# EAGLE design base-3u-motor-controller (EAGLE 5.06)
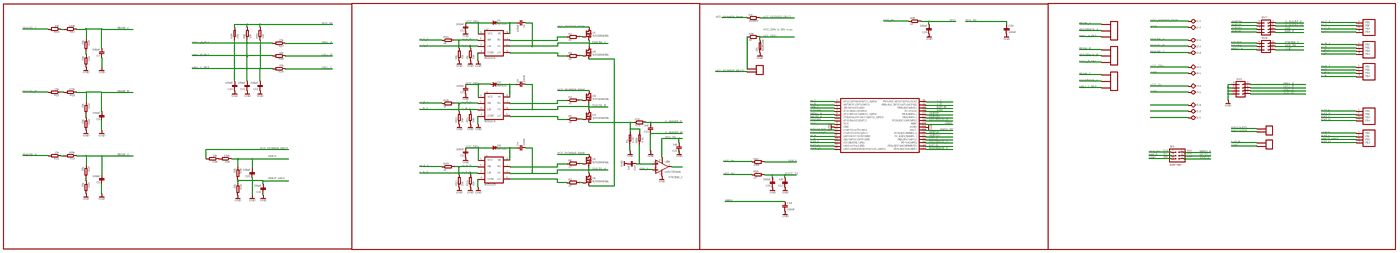
[diagram p0: schematic, sheet 1, overview]
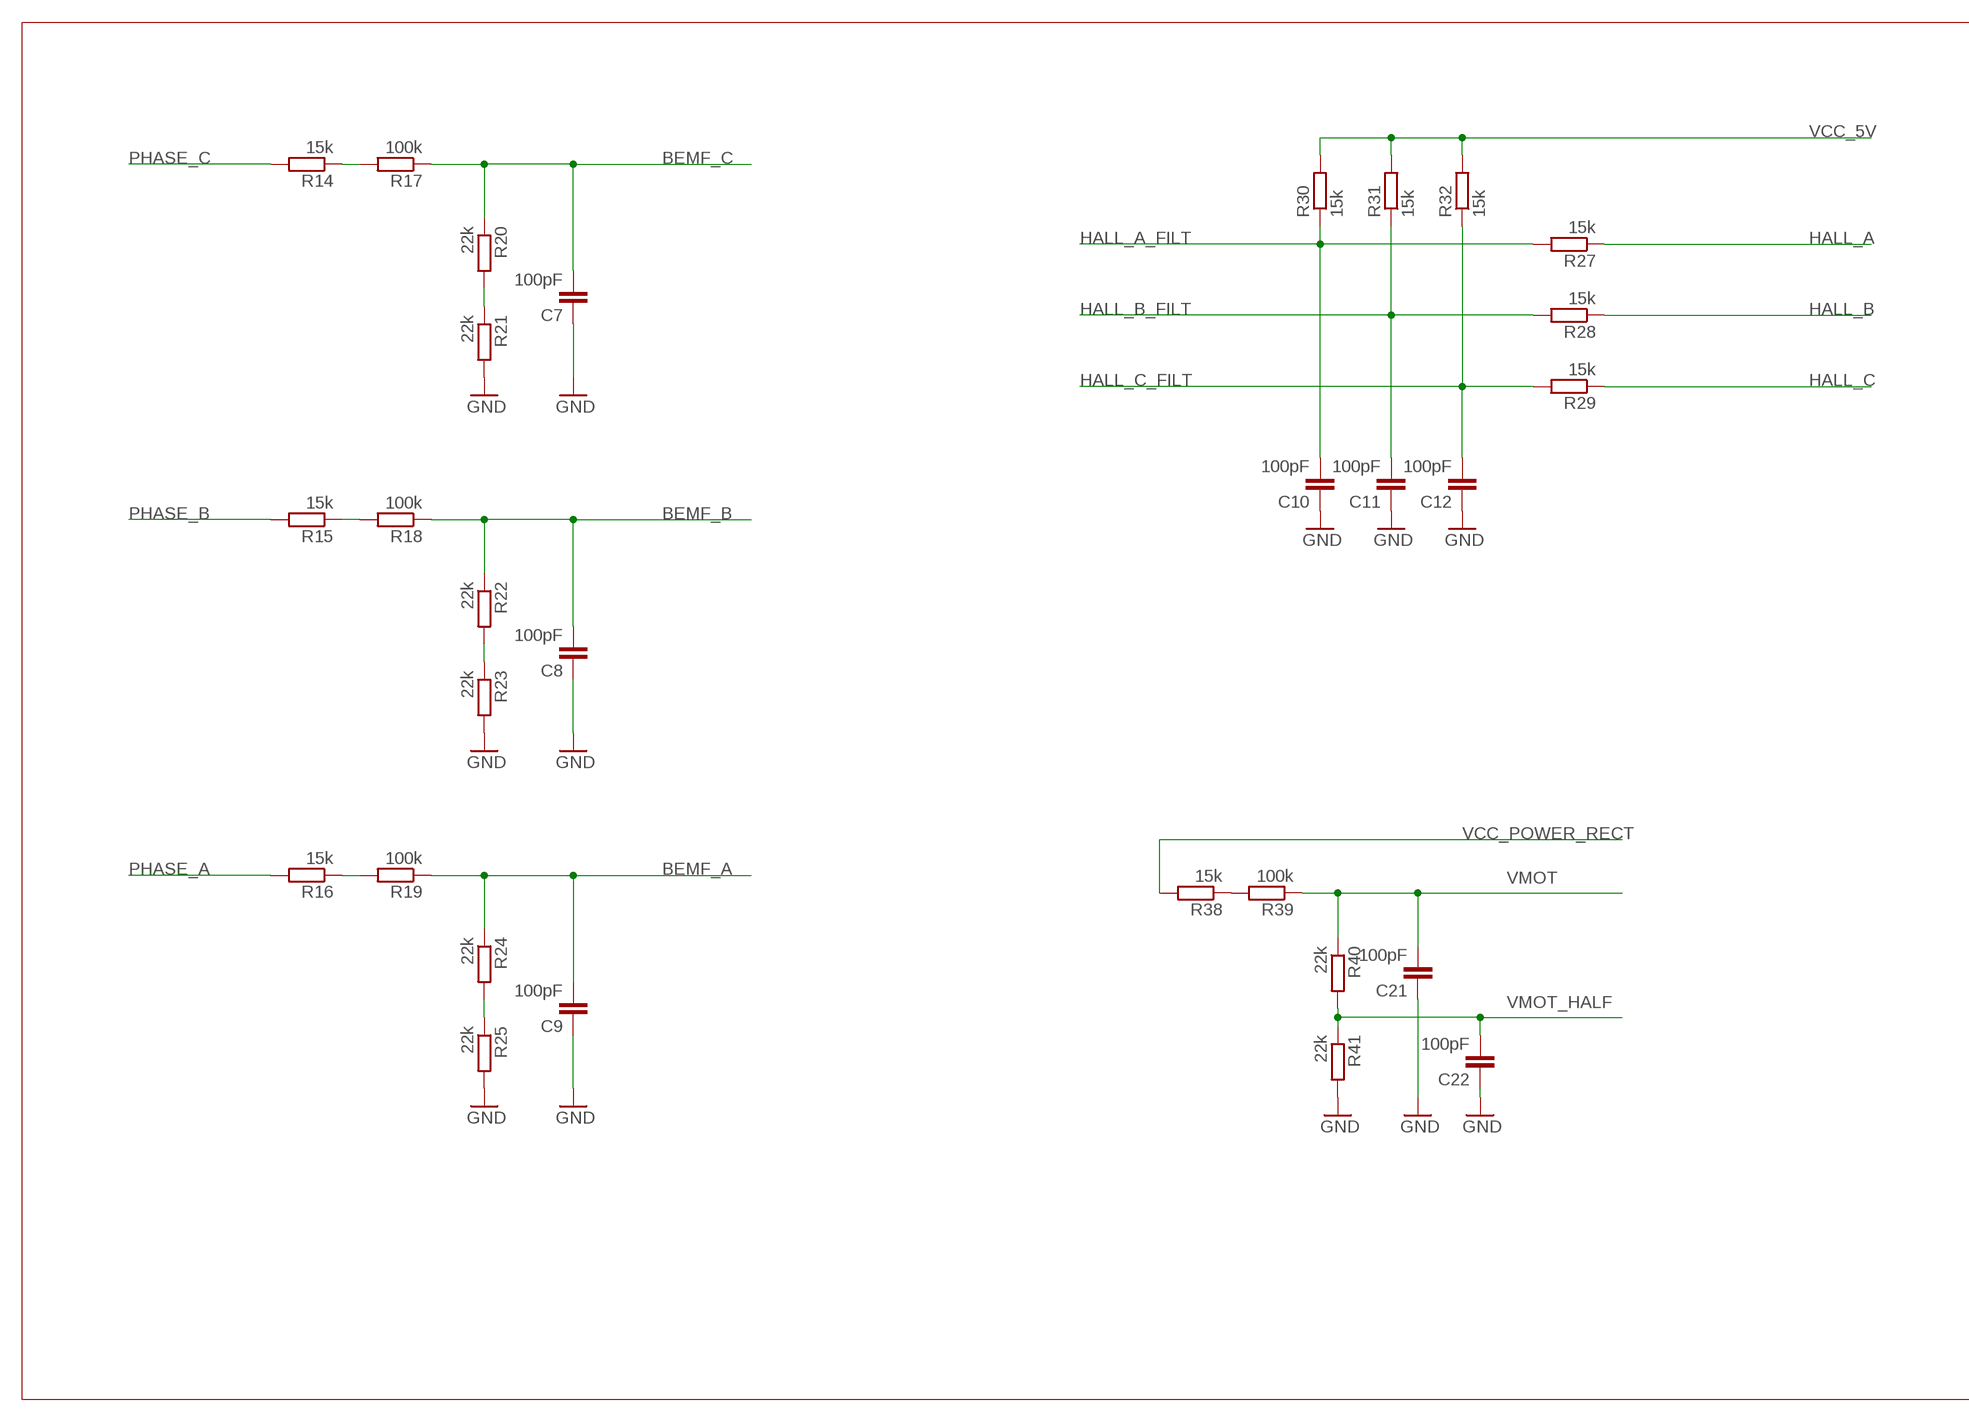
[diagram p1: schematic, sheet 1, part 1 of 4]
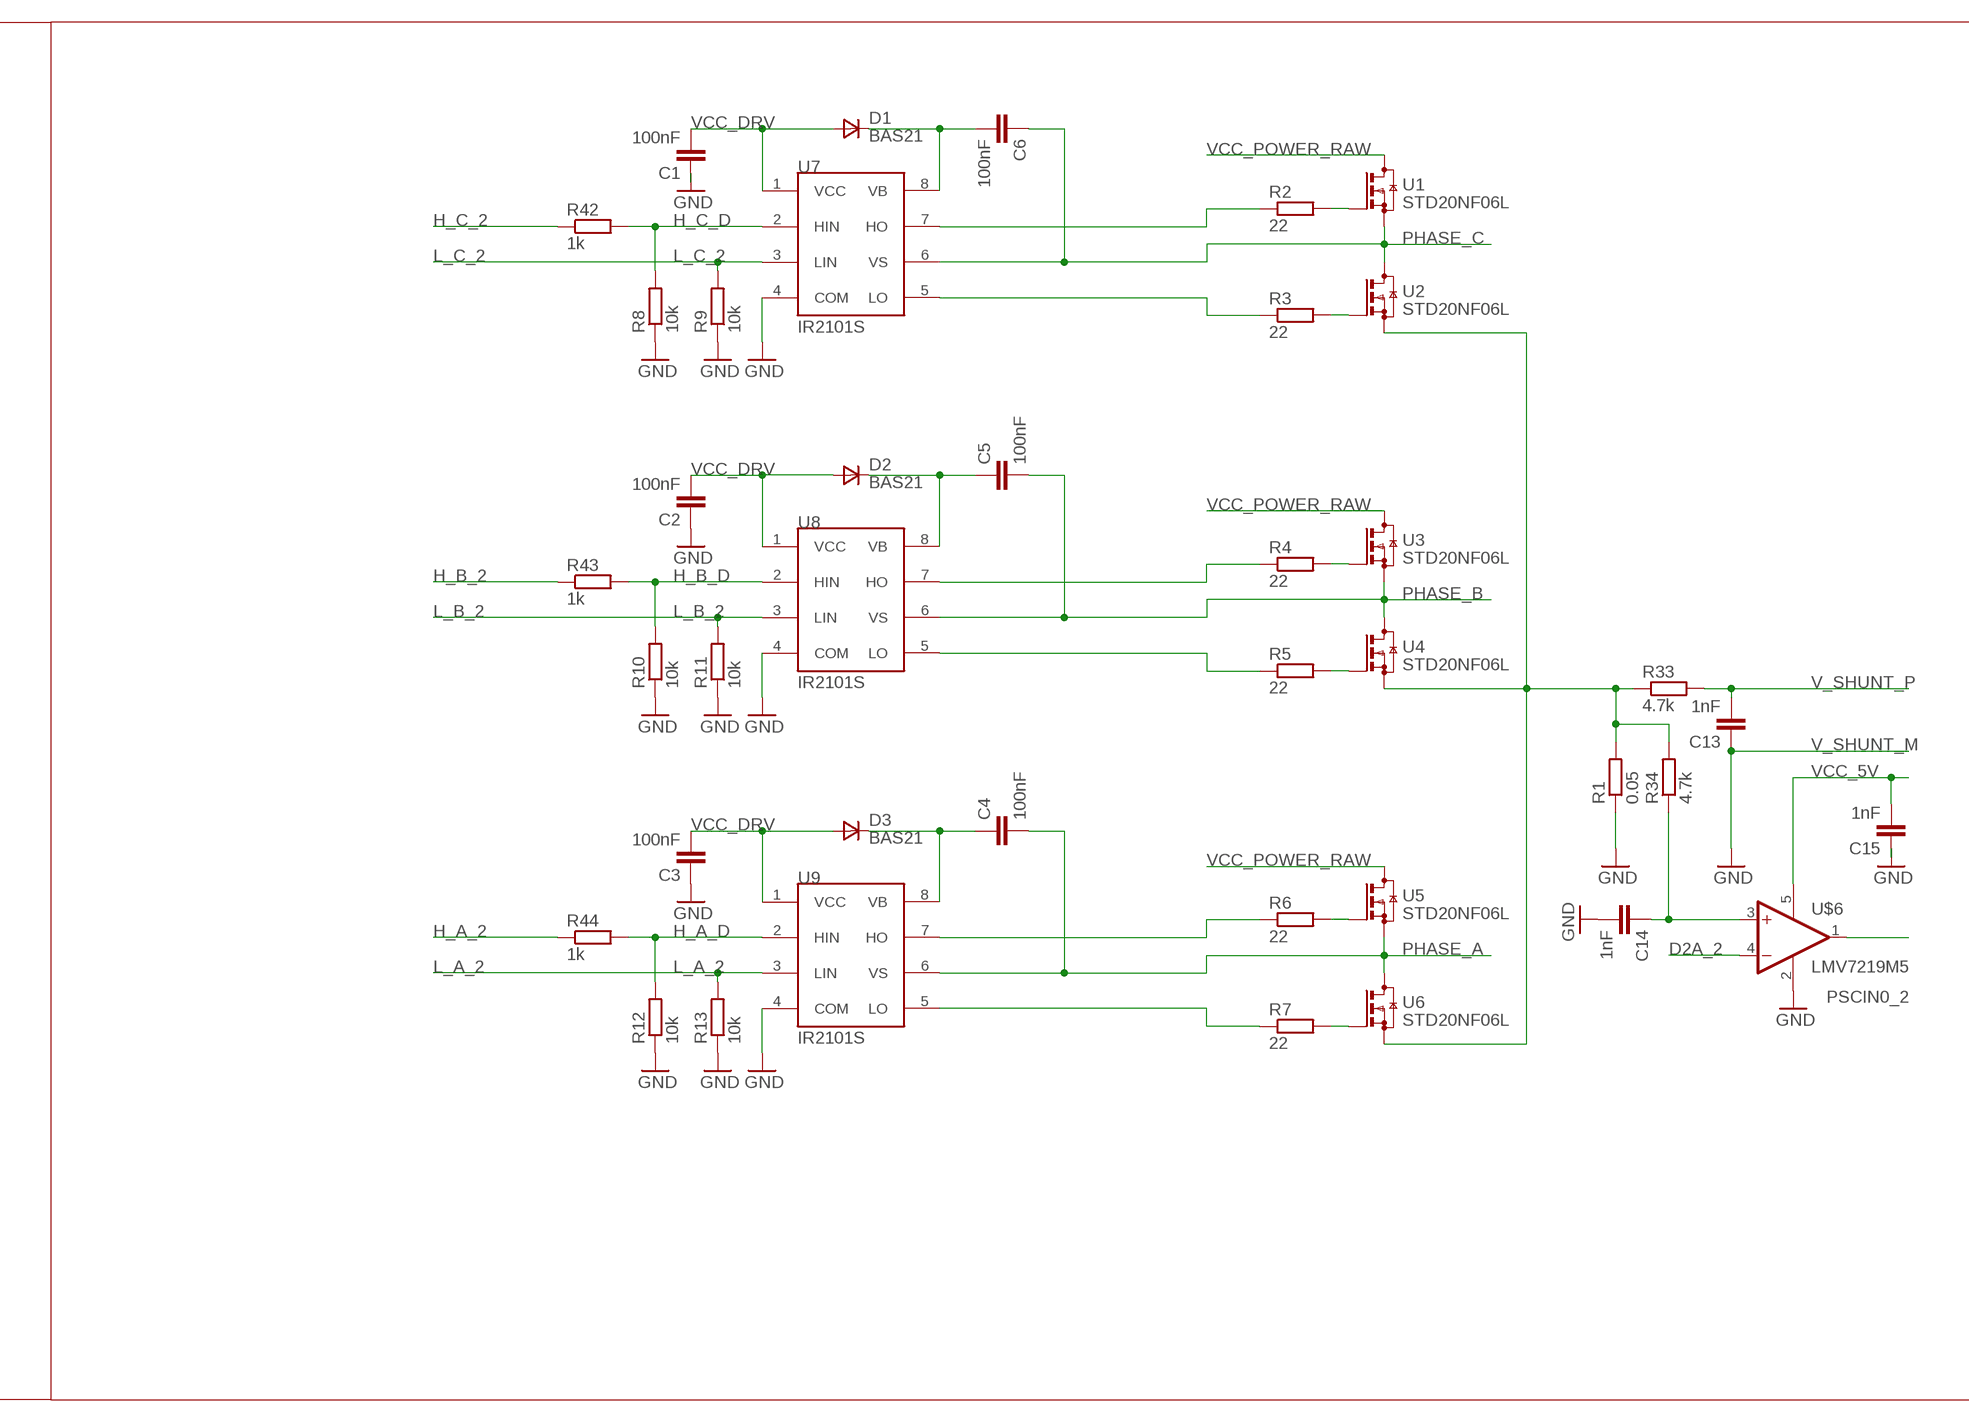
[diagram p2: schematic, sheet 1, part 2 of 4]
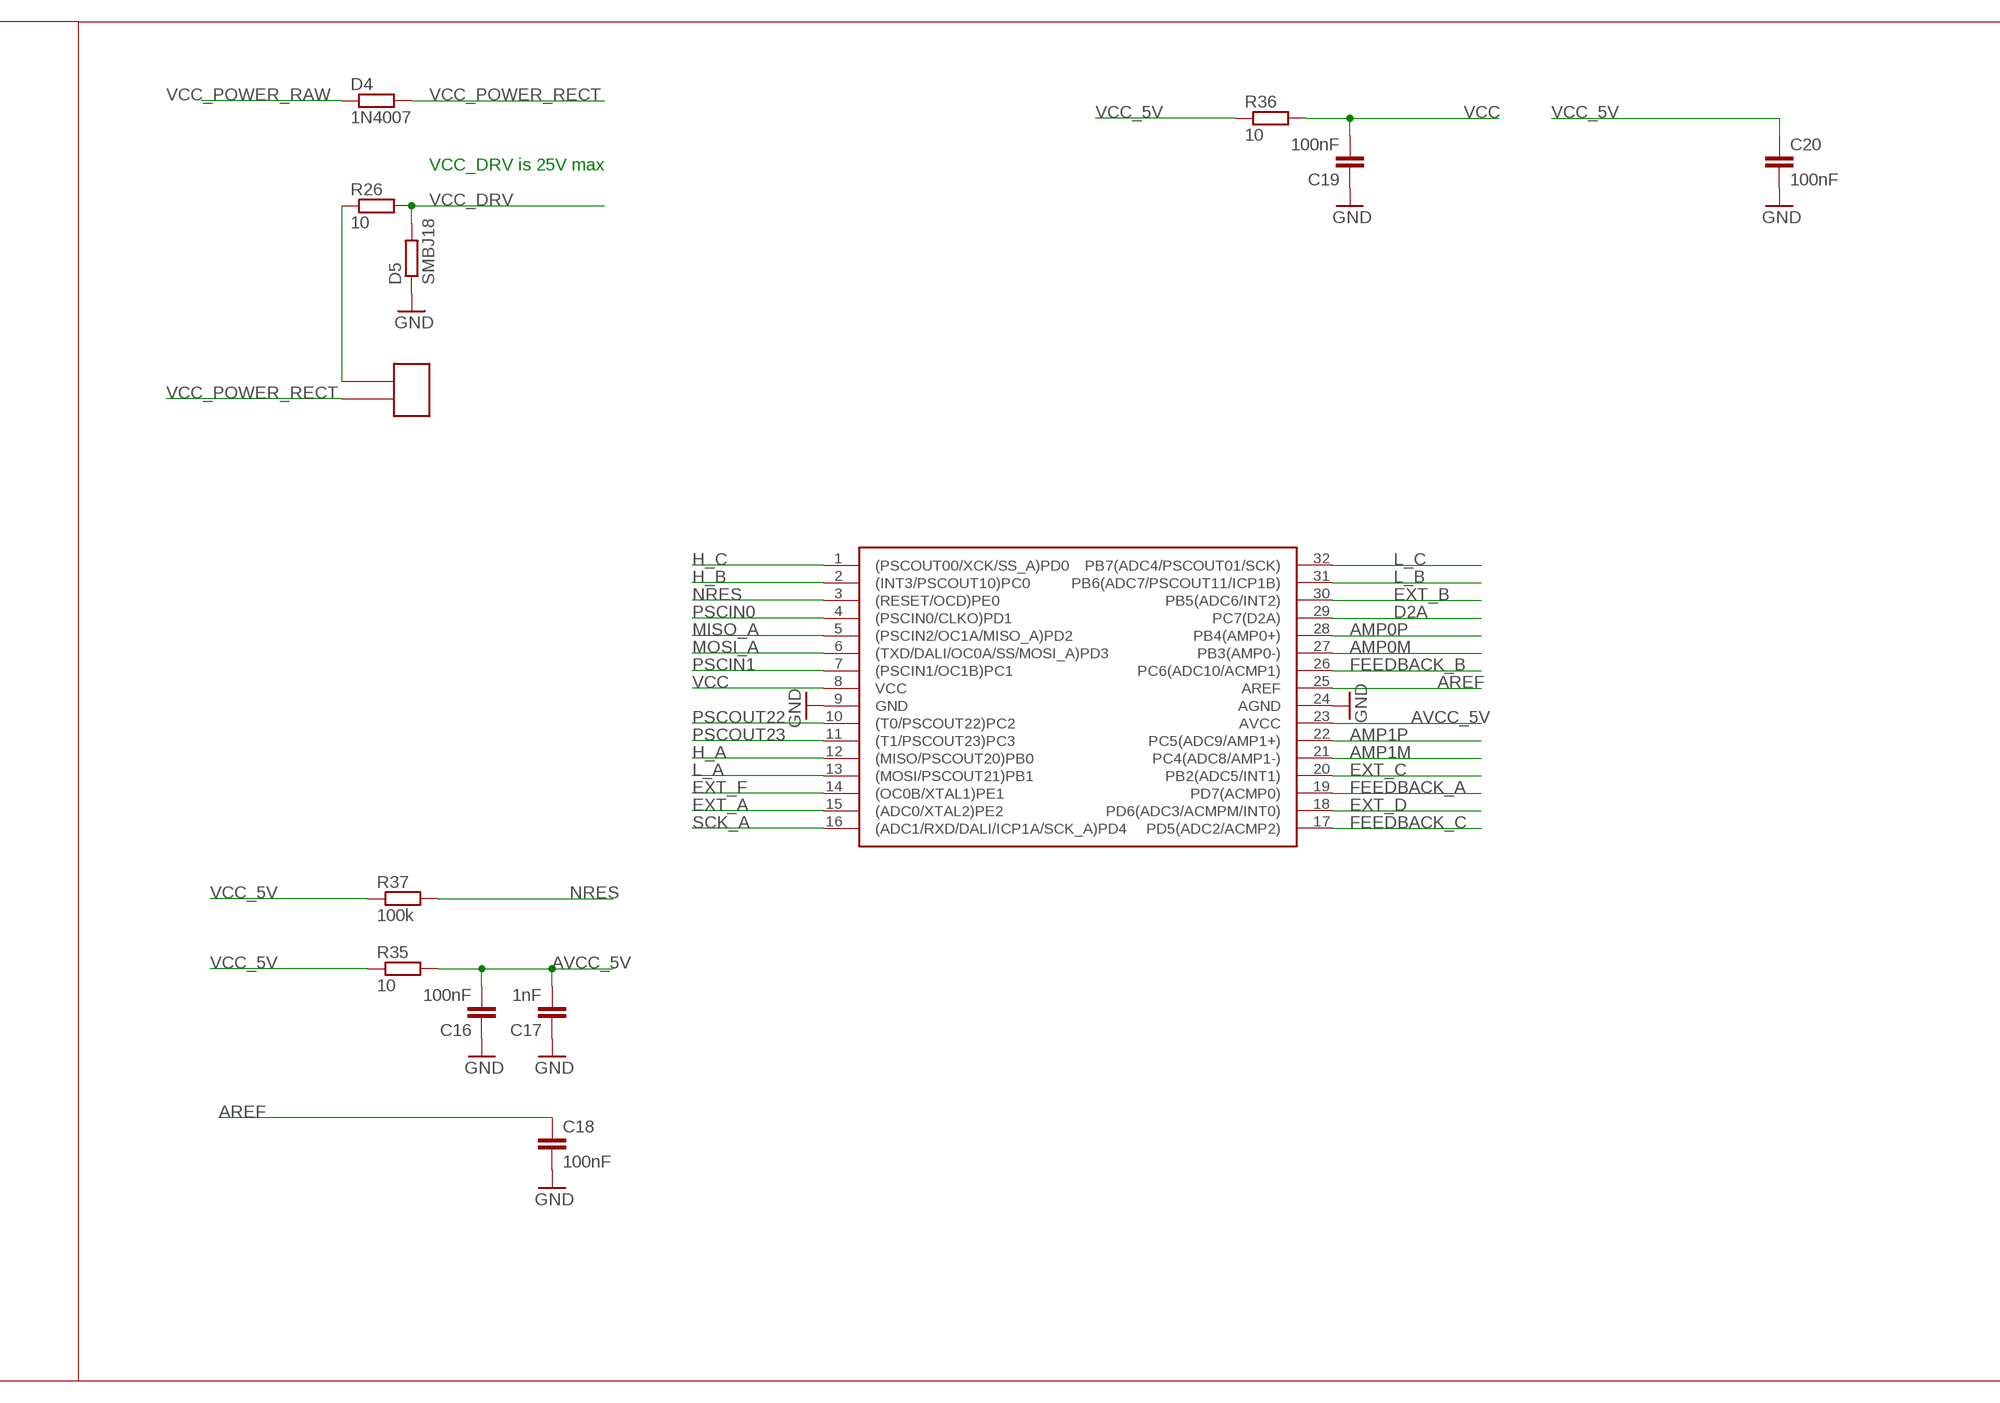
[diagram p3: schematic, sheet 1, part 3 of 4]
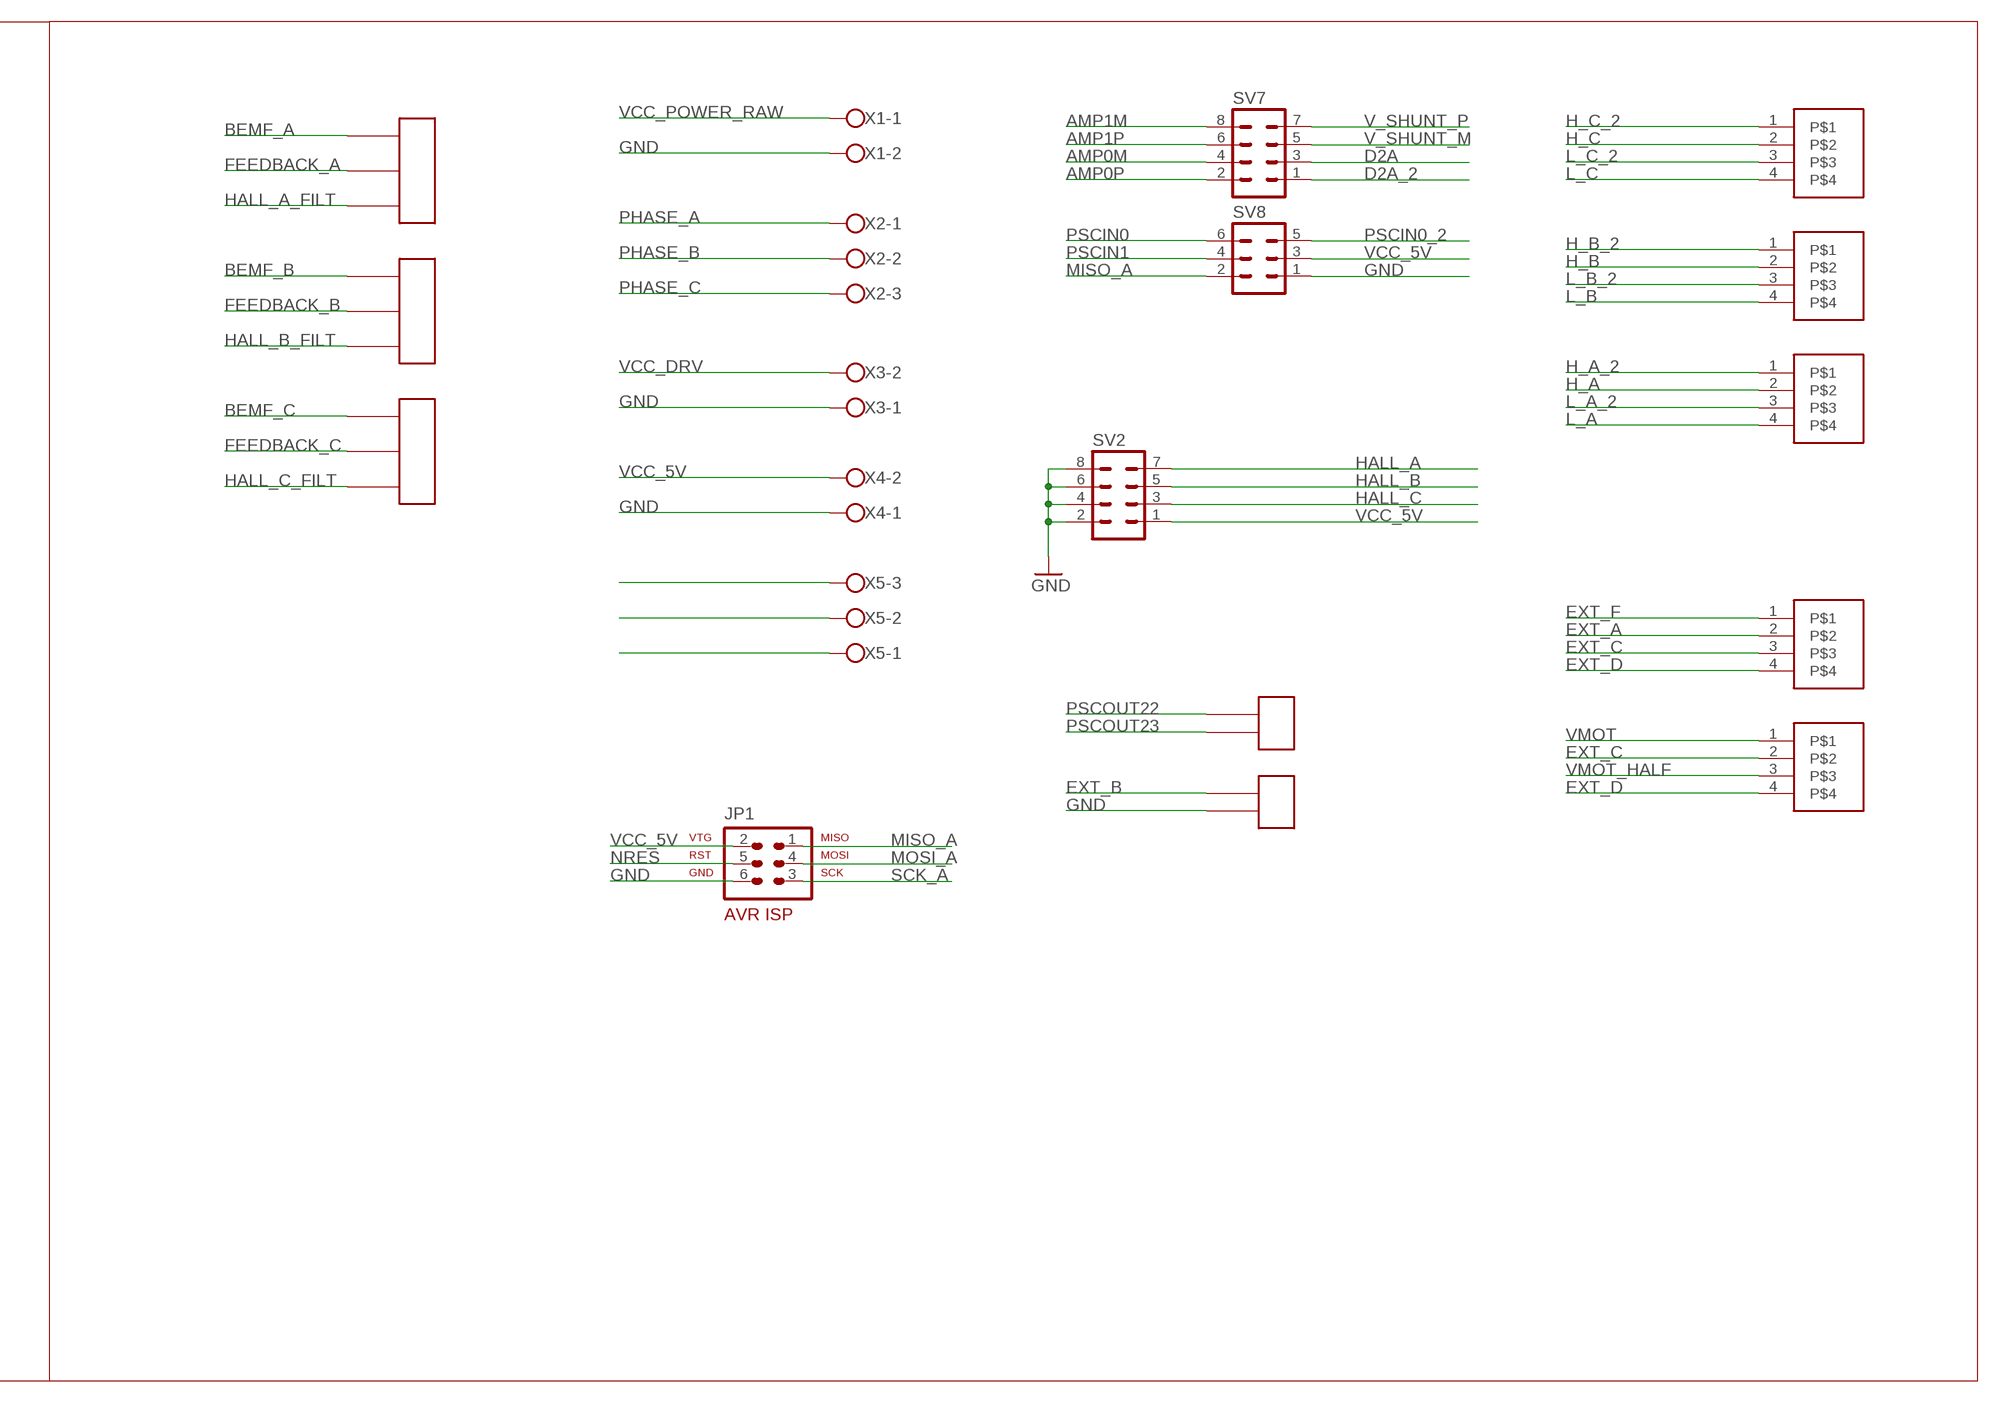
[diagram p4: schematic, sheet 1, part 4 of 4]

## Parts
C1  100nF  C-EUC0805  [C0805]
C2  100nF  C-EUC0805  [C0805]
C3  100nF  C-EUC0805  [C0805]
C4  100nF  C-EUC0805  [C0805]
C5  100nF  C-EUC0805  [C0805]
C6  100nF  C-EUC0805  [C0805]
C7  100pF  C-EUC0805  [C0805]
C8  100pF  C-EUC0805  [C0805]
C9  100pF  C-EUC0805  [C0805]
C10  100pF  C-EUC0805  [C0805]
C11  100pF  C-EUC0805  [C0805]
C12  100pF  C-EUC0805  [C0805]
C13  1nF  C-EUC0805  [C0805]
C14  1nF  C-EUC0805  [C0805]
C15  1nF  C-EUC0805  [C0805]
C16  100nF  C-EUC0805  [C0805]
C17  1nF  C-EUC0805  [C0805]
C18  100nF  C-EUC0805  [C0805]
C19  100nF  C-EUC0805  [C0805]
C20  100nF  C-EUC0805  [C0805]
C21  100pF  C-EUC0805  [C0805]
C22  100pF  C-EUC0805  [C0805]
D1  BAS21  DSOT23  [SOT-23]
D2  BAS21  DSOT23  [SOT-23]
D3  BAS21  DSOT23  [SOT-23]
D4  1N4007  R-EU_R2010  [R2010]
D5  SMBJ18  R-EU_R2010  [R2010]
JP1  AVR-ISP-6  [AVR-ISP-6]
R1  0.05  R-EU_R2512  [R2512]
R2  22  R-EU_R0805  [R0805]
R3  22  R-EU_R0805  [R0805]
R4  22  R-EU_R0805  [R0805]
R5  22  R-EU_R0805  [R0805]
R6  22  R-EU_R0805  [R0805]
R7  22  R-EU_R0805  [R0805]
R8  10k  R-EU_R0805  [R0805]
R9  10k  R-EU_R0805  [R0805]
R10  10k  R-EU_R0805  [R0805]
R11  10k  R-EU_R0805  [R0805]
R12  10k  R-EU_R0805  [R0805]
R13  10k  R-EU_R0805  [R0805]
R14  15k  R-EU_R0805  [R0805]
R15  15k  R-EU_R0805  [R0805]
R16  15k  R-EU_R0805  [R0805]
R17  100k  R-EU_R0805  [R0805]
R18  100k  R-EU_R0805  [R0805]
R19  100k  R-EU_R0805  [R0805]
R20  22k  R-EU_R0805  [R0805]
R21  22k  R-EU_R0805  [R0805]
R22  22k  R-EU_R0805  [R0805]
R23  22k  R-EU_R0805  [R0805]
R24  22k  R-EU_R0805  [R0805]
R25  22k  R-EU_R0805  [R0805]
R26  10  R-EU_R1206  [R1206]
R27  15k  R-EU_R0805  [R0805]
R28  15k  R-EU_R0805  [R0805]
R29  15k  R-EU_R0805  [R0805]
R30  15k  R-EU_R0805  [R0805]
R31  15k  R-EU_R0805  [R0805]
R32  15k  R-EU_R0805  [R0805]
R33  4.7k  R-EU_R0805  [R0805]
R34  4.7k  R-EU_R0805  [R0805]
R35  10  R-EU_R0805  [R0805]
R36  10  R-EU_R0805  [R0805]
R37  100k  R-EU_R0805  [R0805]
R38  15k  R-EU_R0805  [R0805]
R39  100k  R-EU_R0805  [R0805]
R40  22k  R-EU_R0805  [R0805]
R41  22k  R-EU_R0805  [R0805]
R42  1k  R-EU_R0805  [R0805]
R43  1k  R-EU_R0805  [R0805]
R44  1k  R-EU_R0805  [R0805]
SV2  MA04-2  [MA04-2]
SV7  MA04-2  [MA04-2]
SV8  MA03-2  [MA03-2]
U1  STD20NF06L  [TO-252]
U2  STD20NF06L  [TO-252]
U3  STD20NF06L  [TO-252]
U4  STD20NF06L  [TO-252]
U5  STD20NF06L  [TO-252]
U6  STD20NF06L  [TO-252]
U7  IR2101S  [SO8-2]
U8  IR2101S  [SO8-2]
U9  IR2101S  [SO8-2]
U$1  AT90PWM3B-SO32  [SO32]
U$2  MA02-2  [MA04-2]
U$3  MA02-2  [MA04-2]
U$4  MA02-2  [MA04-2]
U$5  MA03-1  [MA03-1]
U$6  LMV7219M5  [SOT23-5]
U$7  MA02-2  [MA04-2]
U$8  MA02-2  [MA04-2]
U$9  MA02-1  [MA02-1]
U$10  MA03-1  [MA03-1]
U$11  MA03-1  [MA03-1]
U$12  MA02-1  [MA02-1]
U$13  MA02-1  [MA02-1]
X1  W237-02P  [W237-132]
X2  W237-03P  [W237-133]
X3  W237-02P  [W237-132]
X4  W237-02P  [W237-132]
X5  W237-03P  [W237-133]

## Nets
AMP0M: SV7.4 U$1.27(PB3(AMP0-))
AMP0P: SV7.2 U$1.28(PB4(AMP0+))
AMP1M: SV7.8 U$1.21(PC4(ADC8/AMP1-))
AMP1P: SV7.6 U$1.22(PC5(ADC9/AMP1+))
AREF: C18.1 U$1.25(AREF)
AVCC_5V: C16.2 C17.2 R35.2 U$1.23(AVCC)
BEMF_A: C9.2 R19.1 R24.1 U$5.P1
BEMF_B: C8.2 R18.1 R22.1 U$10.P1
BEMF_C [prerouted]: C7.2 R17.1 R20.1 U$11.P1
BR_A_H: R6.2 U5.1(G)
BR_A_L: R7.2 U6.1(G)
BR_B_H [prerouted]: R4.2 U3.1(G)
BR_B_L: R5.2 U4.1(G)
BR_C_H [prerouted]: R2.2 U1.1(G)
BR_C_L: R3.2 U2.1(G)
COMP_IN [prerouted]: C14.1 R34.1 U$6.3(+IN)
D2A: SV7.3 U$1.29(PC7(D2A))
D2A_2: SV7.1 U$6.4(-IN)
DRV_A_H: R6.1 U9.7(HO)
DRV_A_L: R7.1 U9.5(LO)
DRV_B_H [prerouted]: R4.1 U8.7(HO)
DRV_B_L: R5.1 U8.5(LO)
DRV_C_H: R2.1 U7.7(HO)
DRV_C_L [prerouted]: R3.1 U7.5(LO)
EXT_A: U$1.15((ADC0/XTAL2)PE2) U$7.2
EXT_B: U$1.30(PB5(ADC6/INT2)) U$13.P1
EXT_C: U$1.20(PB2(ADC5/INT1)) U$7.3 U$8.2
EXT_D: U$1.18(PD6(ADC3/ACMPM/INT0)) U$7.4 U$8.4
EXT_F: U$1.14((OC0B/XTAL1)PE1) U$7.1
FEEDBACK_A: U$1.19(PD7(ACMP0)) U$5.P2
FEEDBACK_B: U$1.26(PC6(ADC10/ACMP1)) U$10.P2
FEEDBACK_C: U$1.17(PD5(ADC2/ACMP2)) U$11.P2
GND [prerouted]: C1.1 C2.1 C3.1 C7.1 C8.1 C9.1 C10.1 C11.1 C12.1 C14.2 C15.1 C16.1 C17.1 C18.2 C19.1 C20.2 C21.1 C22.1 D5.1 JP1.6 R1.1 R8.1 R9.1 R10.1 R11.1 R12.1 R13.1 R21.2 R23.2 R25.2 R41.2 SV2.2 SV2.4 SV2.6 SV2.8 SV8.1 U7.4(COM) U8.4(COM) U9.4(COM) U$1.9(GND) U$1.24(AGND) U$6.2(V-) U$13.P2 X1.2 X3.1 X4.1
GND_ABOVE_SHUNT: R1.2 R33.1 R34.2 U2.2(S) U4.2(S) U6.2(S)
H_A: U$1.12((MISO/PSCOUT20)PB0) U$4.2
H_A_2: R44.1 U$4.1
H_A_D: R12.2 R44.2 U9.2(HIN)
H_B: U$1.2((INT3/PSCOUT10)PC0) U$3.2
H_B_2: R43.1 U$3.1
H_B_D [prerouted]: R10.2 R43.2 U8.2(HIN)
H_C: U$1.1((PSCOUT00/XCK/SS_A)PD0) U$2.2
H_C_2: R42.1 U$2.1
H_C_D [prerouted]: R8.2 R42.2 U7.2(HIN)
HALL_A: R27.1 SV2.7
HALL_A_FILT: C10.2 R27.2 R30.1 U$5.P3
HALL_B: R28.1 SV2.5
HALL_B_FILT: C11.2 R28.2 R31.1 U$10.P3
HALL_C: R29.1 SV2.3
HALL_C_FILT: C12.2 R29.2 R32.1 U$11.P3
L_A: U$1.13((MOSI/PSCOUT21)PB1) U$4.4
L_A_2: R13.2 U9.3(LIN) U$4.3
L_B: U$1.31(PB6(ADC7/PSCOUT11/ICP1B)) U$3.4
L_B_2 [prerouted]: R11.2 U8.3(LIN) U$3.3
L_C: U$1.32(PB7(ADC4/PSCOUT01/SCK)) U$2.4
L_C_2: R9.2 U7.3(LIN) U$2.3
MISO_A: JP1.1 SV8.2 U$1.5((PSCIN2/OC1A/MISO_A)PD2)
MOSI_A: JP1.4 U$1.6((TXD/DALI/OC0A/SS/MOSI_A)PD3)
N$5: R38.1 R39.2
N$9: R24.2 R25.1
N$10: R26.1 U$12.P1
N$12: R16.1 R19.2
N$13: R22.2 R23.1
N$15: R15.1 R18.2
N$16: R20.2 R21.1
N$19: R14.1 R17.2
NRES: JP1.5 R37.2 U$1.3((RESET/OCD)PE0)
PHASE_A [power_086]: C4.2 R16.2 U5.2(S) U6.3(D) U9.6(VS) X2.1
PHASE_B [power_086]: C5.2 R15.2 U3.2(S) U4.3(D) U8.6(VS) X2.2
PHASE_C [power_086]: C6.1 R14.2 U1.2(S) U2.3(D) U7.6(VS) X2.3
PSCIN0: SV8.6 U$1.4((PSCIN0/CLKO)PD1)
PSCIN0_2 [prerouted]: SV8.5 U$6.1(OUT)
PSCIN1: SV8.4 U$1.7((PSCIN1/OC1B)PC1)
PSCOUT22: U$1.10((T0/PSCOUT22)PC2) U$9.P1
PSCOUT23: U$1.11((T1/PSCOUT23)PC3) U$9.P2
SCK_A: JP1.3 U$1.16((ADC1/RXD/DALI/ICP1A/SCK_A)PD4)
V_SHUNT_M: C13.1 SV7.5 ; supply symbol labelled GND
V_SHUNT_P: C13.2 R33.2 SV7.7
VB_A: C4.1 D3.1(C) U9.8(VB)
VB_B [prerouted]: C5.1 D2.1(C) U8.8(VB)
VB_C [prerouted]: C6.2 D1.1(C) U7.8(VB)
VCC: C19.2 R36.2 U$1.8(VCC)
VCC_5V [prerouted]: C15.2 C20.1 JP1.2 R30.2 R31.2 R32.2 R35.1 R36.1 R37.1 SV2.1 SV8.3 U$6.5(V+) X4.2
VCC_DRV [prerouted]: C1.2 C2.2 C3.2 D1.3(A) D2.3(A) D3.3(A) D5.2 R26.2 U7.1(VCC) U8.1(VCC) U9.1(VCC) X3.2
VCC_POWER_RAW [power_086]: D4.1 U1.3(D) U3.3(D) U5.3(D) X1.1 X5.1 X5.2 X5.3
VCC_POWER_RECT: D4.2 R38.2 U$12.P2
VMOT: C21.2 R39.1 R40.1 U$8.1
VMOT_HALF: C22.2 R40.2 R41.1 U$8.3

## Notes on the sheet
- VCC_DRV is 25V max

## Library data of the parts
C1-C22 = rcl:C-EU: CAPACITOR, European symbol
D1-D3 = zetex:D: DIODE
D4 D5 R1-R44 = rcl:R-EU_: RESISTOR, European symbol
JP1 = my-atmel:AVR-ISP-6: AVR ISP-6 Serial Programming Header
SV2 SV7 = con-lstb:MA04-2: PIN HEADER
SV8 = con-lstb:MA03-2: PIN HEADER
U1-U6 = my-std20nf06l:STD20NF06L: STD20NF06L N-channel DPAK (TO-252) MOSFET transistor
U7-U9 = my-irf:IR2101: High and low side driver
U$1 = my-at90pwm3:AT90PWM3B: AT90PWM3B, SO32
U$2-U$4 U$7 U$8 = my-con:MA02-2
U$5 U$10 U$11 = my-con:MA03-1
U$6 = my-opamp:LMV7219M5
U$9 U$12 U$13 = my-con:MA02-1
X1 X3 X4 = con-wago-508:W237-02P: WAGO SREW CLAMP
X2 X5 = con-wago-508:W237-03P: WAGO SREW CLAMP

## Net classes
0 default: width 0.406 mm
1 prerouted: width 0.61 mm, drill 0.889 mm
2 power_086: width 2.184 mm, clearance 0.406 mm

## Board
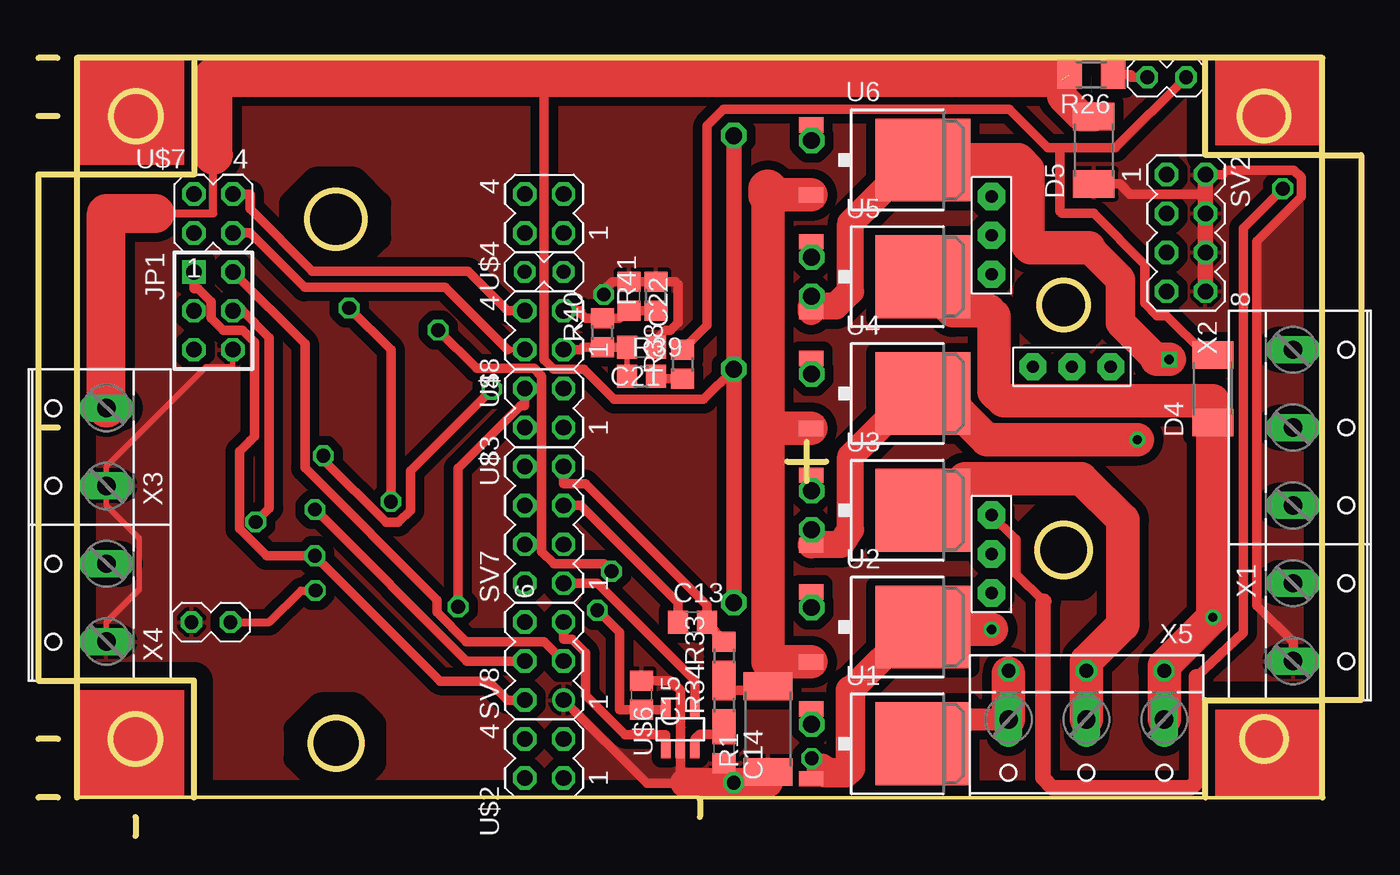
[diagram p5: board, top side]
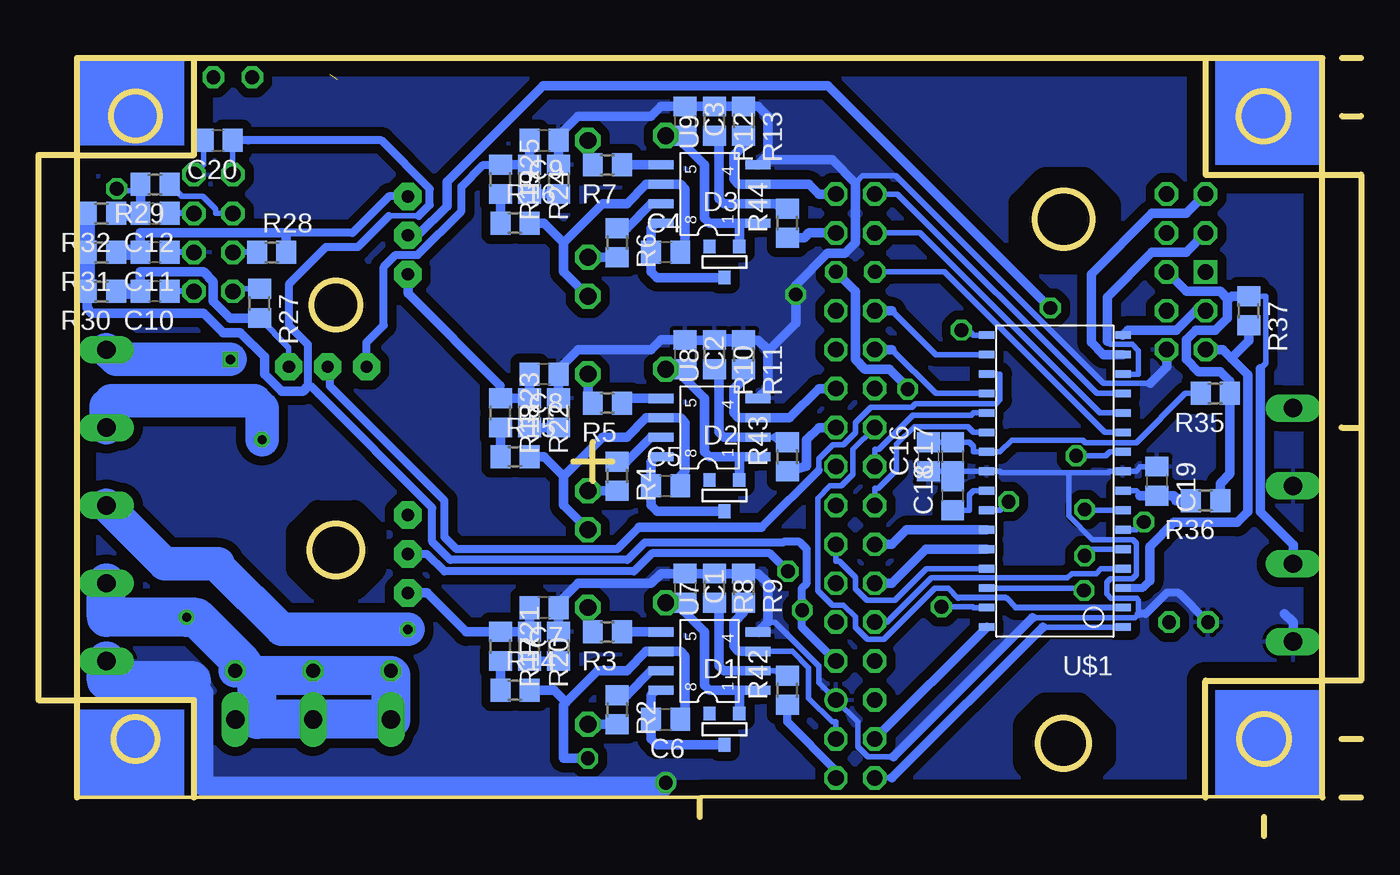
[diagram p6: board, bottom side, seen from below]

Size 86.36 x 50.8 mm. Coordinates in mm from the lower left corner, seen from the top.
Outline: 2.54,2.56 83.82,2.52
Outline: 43.18,2.4 43.18,1.27
Outline: 1.27,50.8 0,50.8
Outline: 1.27,2.54 0,2.54
Outline: 1.27,26.67 0,26.67
Outline: 48.89,24.45 51.44,24.45
Outline: 50.16,23.18 50.16,25.72
Outline: 2.54,2.54 2.54,10.16
Outline: 2.54,10.16 2.54,43.18
Outline: 2.54,43.18 2.54,50.8 10.16,50.8
Outline: 83.82,2.54 83.82,8.89
Outline: 83.82,8.89 83.82,44.45
Outline: 83.82,44.45 83.82,50.8 76.2,50.8
Outline: 76.2,50.8 10.16,50.8
Outline: 10.16,2.54 10.16,10.16 2.54,10.16
Outline: 76.2,2.54 76.2,8.89 83.82,8.89
Outline: 83.82,44.45 76.2,44.45 76.2,50.8
Outline: 10.16,50.8 10.16,43.18 2.54,43.18
Outline: 2.54,43.18 0,43.18 0,10.16 2.54,10.16
Outline: 83.82,44.45 86.36,44.45 86.36,8.89 83.82,8.89
Outline: 1.27,6.35 0,6.35
Outline: 1.27,46.99 0,46.99
Outline: 6.35,1.27 6.35,0
Outline: circle at 19.43,40.27 radius 1.86
Outline: circle at 19.43,6.07 radius 1.66
Outline: circle at 66.93,18.67 radius 1.71
Outline: circle at 66.93,34.67 radius 1.57
Outline: circle at 6.35,6.35 radius 1.6
Outline: circle at 6.37,46.99 radius 1.61
Outline: circle at 80.01,6.35 radius 1.41
Outline: circle at 80.01,46.99 radius 1.58
Copper layers (1*16): Top 0.035mm / dielectric 1.5mm / Bottom 0.035mm
Design rules "default": minimum track width 10mil, minimum drill 24mil, track to track 8mil, track to pad 8mil, pad to pad 8mil, via to via 8mil, smd to smd 8mil, copper to edge 40mil, drill to drill 8mil, minimum pad ring 10mil, minimum via ring 8mil, stop-mask expansion 4mil, vias tented up to drill 0mil, thermal gap 10mil
tRestrict: area 16.5,37.5 to 22.2,42.9; area 16.8,3.5 to 21.9,8.6; area 64.5,32.4 to 69.4,37.1; area 64.5,16.2 to 69.4,21.1
bRestrict: area 16.8,3.5 to 21.9,8.6; area 64.5,32.4 to 69.4,37.1; area 64.5,16.2 to 69.4,21.1; area 16.5,37.5 to 22.2,42.9

### Footprints (pad centres in the part's own frame; a part is rotated, then mirrored left to right if it is on the bottom)
C0805 = smd 1.3 x 1.5: 1 -0.95,0; 2 0.95,0
SOT-23 = smd 0.787 x 0.889: 1 0.025,-1.016; 2 -0.94,1.016; 3 0.991,1.016
R2010 = smd 1.8 x 2.7: 1 -2.2,0; 2 2.2,0
AVR-ISP-6 = drill 1.016 square: 1 -2.54,-1.27 | drill 1.016 octagon: 2 -2.54,1.27; 3 0,-1.27; 4 0,1.27; 5 2.54,-1.27; 6 2.54,1.27
R2512 = smd 1.8 x 3.2: 1 -2.8,0; 2 2.8,0
R0805 = smd 1.3 x 1.5: 1 -0.95,0; 2 0.95,0
R1206 = smd 1.6 x 1.803: 1 -1.422,0; 2 1.422,0
MA04-2 = drill 1.016 octagon: 1 -3.81,-1.27; 2 -3.81,1.27; 3 -1.27,-1.27; 4 -1.27,1.27; 5 1.27,-1.27; 6 1.27,1.27; 7 3.81,-1.27; 8 3.81,1.27
MA03-2 = drill 1.016 round: 1 -2.54,-1.27 | drill 1.016 octagon: 2 -2.54,1.27; 3 0,-1.27; 4 0,1.27; 5 2.54,-1.27; 6 2.54,1.27
TO-252 = smd 1 x 1.6: 1 -2.28,-6.07; 2 2.28,-6.07 | smd 5.4 x 6.2: 3 0,1.23
SO8-2 = smd 0.61 x 1.626: 1 -2.54,-2.54; 2 -1.27,-2.54; 3 0,-2.54; 4 1.27,-2.54; 5 1.27,3.81; 6 0,3.81; 7 -1.27,3.81; 8 -2.54,3.81
SO32 = smd 1.016 x 0.508: 1 -4.445,9.525; 2 -4.445,8.255; 3 -4.445,6.985; 4 -4.445,5.715; 5 -4.445,4.445; 6 -4.445,3.175; 7 -4.445,1.905; 8 -4.445,0.635; 9 -4.445,-0.635; 10 -4.445,-1.905; 11 -4.445,-3.175; 12 -4.445,-4.445; 13 -4.445,-5.715; 14 -4.445,-6.985; 15 -4.445,-8.255; 16 -4.445,-9.525; 17 4.445,-9.525; 18 4.445,-8.255; 19 4.445,-6.985; 20 4.445,-5.715; 21 4.445,-4.445; 22 4.445,-3.175; 23 4.445,-1.905; 24 4.445,-0.635; 25 4.445,0.635; 26 4.445,1.905; 27 4.445,3.175; 28 4.445,4.445; 29 4.445,5.715; 30 4.445,6.985; 31 4.445,8.255; 32 4.445,9.525
MA04-2' = drill 1.016 octagon: 1 -1.27,-1.27; 2 -1.27,1.27; 3 1.27,-1.27; 4 1.27,1.27
MA03-1 = drill 0.8 pad 1.778 octagon: P1 -2.54,0; P2 0,0; P3 2.54,0
SOT23-5 = smd 0.6 x 1.2: 1 -0.95,-1.306; 2 0,-1.306; 3 0.95,-1.306; 4 0.95,1.306; 5 -0.95,1.306
MA02-1 = drill 0.9 octagon: P1 -1.27,0; P2 1.27,0
W237-132 = drill 1.194 long: 1 -2.54,-0.635; 2 2.54,-0.635
W237-133 = drill 1.194 long: 1 -5.08,-0.635; 2 0,-0.635; 3 5.08,-0.635

### Placement (x,y rotation side)
C1  44.13,16.19 270 bottom
C2  44.13,31.43 270 bottom
C3  44.13,46.67 270 bottom
C4  45.4,38.1 0 bottom
C5  45.4,22.86 0 bottom
C6  45.4,7.62 180 bottom
C7  53.34,14.92 180 bottom
C8  53.34,30.16 180 bottom
C9  53.34,45.4 180 bottom
C10  78.74,35.56 180 bottom
C11  78.74,38.1 180 bottom
C12  78.74,40.64 180 bottom
C13  42.7,13.97 0 top
C14  44.77,5.71 270 top
C15  39.37,9.21 270 top
C16  28.26,24.77 90 bottom
C17  26.67,24.77 90 bottom
C18  26.67,22.22 90 bottom
C19  13.34,23.18 270 bottom
C20  74.61,45.4 180 bottom
C21  39.37,31.91 180 top
C22  38.58,35.24 270 top
D1  41.59,6.98 0 bottom
D2  41.59,22.22 0 bottom
D3  41.59,37.47 0 bottom
D4  76.68,29.21 90 top
D5  68.9,44.77 90 top
JP1  11.43,34.29 270 top
R1  47.62,6.98 90 top
R2  48.58,8.26 270 bottom
R3  49.21,13.33 180 bottom
R4  48.58,23.5 270 bottom
R5  49.21,28.26 180 bottom
R6  48.58,38.74 270 bottom
R7  49.21,43.82 180 bottom
R8  42.23,16.19 270 bottom
R9  40.32,16.19 270 bottom
R10  42.23,31.43 270 bottom
R11  40.32,31.43 270 bottom
R12  42.23,46.67 270 bottom
R13  40.32,46.67 270 bottom
R14  55.24,9.53 0 bottom
R15  55.24,24.77 0 bottom
R16  55.24,40.01 0 bottom
R17  56.2,12.38 270 bottom
R18  56.2,27.62 270 bottom
R19  56.2,42.86 270 bottom
R20  54.29,12.38 270 bottom
R21  52.39,12.38 90 bottom
R22  54.29,27.62 270 bottom
R23  52.39,27.62 90 bottom
R24  54.29,42.86 270 bottom
R25  52.39,42.86 90 bottom
R26  68.74,49.69 180 top
R27  71.91,34.77 270 bottom
R28  71.12,38.1 0 bottom
R29  78.74,42.55 180 bottom
R30  82.23,35.56 180 bottom
R31  82.23,38.1 180 bottom
R32  82.23,40.64 180 bottom
R33  44.77,11.75 90 top
R34  44.77,8.57 90 top
R35  9.53,28.89 180 bottom
R36  10.16,21.91 180 bottom
R37  7.34,34.29 270 bottom
R38  42.07,30.8 90 top
R39  39.37,30 0 top
R40  36.83,32.86 90 top
R41  40.32,35.24 90 top
R42  37.47,9.53 90 bottom
R43  37.46,24.77 90 bottom
R44  37.47,40.01 90 bottom
SV2  74.93,39.37 270 top
SV7  33.02,20.32 90 top
SV8  33.02,11.43 90 top
U1  56.52,6.03 270 top
U2  56.52,13.65 270 top
U3  56.52,21.27 270 top
U4  56.52,28.89 270 top
U5  56.52,36.51 270 top
U6  56.52,44.13 270 top
U7  41.91,12.06 90 bottom
U8  41.91,27.3 90 bottom
U9  41.91,42.55 90 bottom
U$1  20,23.18 180 bottom
U$2  MA02-2  [MA04-2']  33.02,5.08 90 top
U$3  MA02-2  [MA04-2']  33.02,27.94 90 top
U$4  MA02-2  [MA04-2']  33.02,40.64 90 top
U$5  67.47,30.64 0 top
U$6  41.91,6.98 0 top
U$7  MA02-2  [MA04-2']  11.43,40.64 0 top
U$8  MA02-2  [MA04-2']  33.02,33.02 90 top
U$9  33.02,36.83 180 top
U$10  62.23,39.21 90 top
U$11  62.23,18.41 90 top
U$12  73.66,49.53 0 top
U$13  11.27,13.97 180 top
X1  82.55,13.97 270 top
X2  82.55,26.67 270 top
X3  3.81,25.4 90 top
X4  3.81,15.24 90 top
X5  68.42,6.98 180 top

### Tracks (layer width: path | path; a pad name or v marks a point on that pad's centre or on a via)
AMP0M
  Bottom 0.61: U$1.27 25.31,20 29.68,20 30.63,19.05 SV7.4
AMP0P
  Bottom 0.61: U$1.28 25.31,18.73 28.41,18.73 30.63,16.51 SV7.2
AMP1M
  Bottom 0.356: SV7.8 31.75,25.25 31.5,25.25 29.27,27.47 25.46,27.47 25.31,27.62 U$1.21
AMP1P
  Bottom 0.356: SV7.6 31.75,22.71 31.52,22.71 30.33,23.9 30.33,25.57 29.18,26.72 25.68,26.72 25.31,26.35 U$1.22
AREF
  Bottom 0.356: C18.1 25.56,21.27 25.56,22.29 25.31,22.54 U$1.25
AVCC_5V
  Bottom 0.356: R35.2 11.48,28.89 14.68,25.69 18.02,25.69 18.18,25.85 22.81,25.85 23.58,25.08 24.43,25.08 U$1.23 25.31,25.08 25.31,25.46 25.56,25.71 C17.2 C16.2
BEMF_A
  Bottom 0.508: U$5.P1 64.93,32.23 63.82,33.34 63.82,37.15 63.02,37.94 61.59,37.94 58.74,40.8 58.74,42.39 57.31,43.82 R19.1
  Bottom 0.61: R19.1 R24.1 C9.2
BEMF_B
  Bottom 0.356: R18.1 56.2,29.4
  Bottom 0.406: R18.1
  Bottom 0.61: U$10.P1 62.23,35.43 56.2,29.4 | C8.2 R22.1 R18.1
BEMF_C
  Bottom 0.61: U$11.P1 60.98,15.88 58.44,13.33 R17.1 R20.1 C7.2
BR_A_H  (via drill 1.1 pad 1.65)
  Top 0.61: v50.48,37.78 50.48,38.76 U5.1
  Bottom 0.61: R6.2 v50.48,37.79 v50.48,37.78
BR_A_L  (via drill 1.1 pad 1.65)
  Top 0.61: v50.48,45.4 50.45,45.44 U6.1
  Bottom 0.61: R7.2 50.48,44.14 v50.48,45.4
BR_B_H  (via drill 1.1 pad 1.65)
  Top 0.61: v50.48,22.54 50.48,23.5 50.45,23.53 U3.1
  Bottom 0.61: R4.2 v50.48,22.54
BR_B_L  (via drill 1.1 pad 1.65)
  Top 0.61: v50.48,30.16 50.45,30.2 U4.1
  Bottom 0.61: R5.2 50.48,28.57 v50.48,30.16
BR_C_H  (via drill 1.1 pad 1.65)
  Top 0.61: v50.48,7.3 50.45,7.34 U1.1
  Bottom 0.61: R2.2 v50.48,7.3
BR_C_L  (via drill 1.1 pad 1.65)
  Top 0.61: v50.48,14.92 50.45,14.96 U2.1
  Bottom 0.61: R3.2 50.48,13.65 v50.48,14.92
COMP_IN
  Top 0.61: U$6.3 42.86,6.35 43.18,6.67 C14.1 | C14.1 44.77,7.3 | C14.1 44.77,7.3 R34.1
D2A
  Bottom 0.356: SV7.3 34.29,17.93 34.06,17.93 33.02,16.89 33.02,16.16 32.25,15.39 30.44,15.39 28.37,17.46 U$1.29
D2A_2
  Top 0.61: U$6.4 42.86,10.16 36.51,16.51 SV7.1
DRV_A_H
  Bottom 0.61: U9.7 46.35,41.28 47.94,39.69 R6.1
DRV_A_L
  Bottom 0.61: U9.5 R7.1
DRV_B_H
  Bottom 0.61: U8.7 46.35,26.04 47.95,24.45 R4.1
DRV_B_L
  Bottom 0.61: U8.5 47.95,28.57 R5.1
DRV_C_H
  Bottom 0.61: U7.7 46.35,10.79 47.94,9.21 R2.1
DRV_C_L
  Bottom 0.61: U7.5 R3.1
EXT_A
  Bottom 0.61: U$7.2 11.43,40.64 13.65,40.64 17.62,36.67 17.62,32.23 16.83,31.43 U$1.15
EXT_B  (via drill 0.9 pad 1.35)
  Top 0.508: v18.1,16.03 17.14,16.03 15.08,13.97 U$13.P1
  Bottom 0.356: U$1.30 18.26,16.19 v18.1,16.03
EXT_C
  Top 0.356: U$8.2 30.63,31.75
  Top 0.61: U$7.3 13.82,39.37 17.37,35.82 26.57,35.82 30.63,31.75
  Bottom 0.356: 30.63,31.75 27.77,28.89 25.31,28.89 U$1.20
  Bottom 0.61: 30.63,31.75 U$8.2
EXT_D
  Top 0.61: U$8.4 30.63,34.29 28.06,36.86 17.89,36.86 13.82,40.93 13.82,41.91 U$7.4
  Bottom 0.356: 30.63,34.29 27.77,31.43 U$1.18
  Bottom 0.61: 30.63,34.29 U$8.4
EXT_F
  Bottom 0.356: U$1.14 14.54,30.16 14.54,31.68 14.95,32.09 16.37,32.09 16.58,32.3
  Bottom 0.61: U$7.1 11.43,38.1 13.65,38.1 16.58,35.17 16.58,32.3
FEEDBACK_A
  Bottom 0.356: 35.41,23.9 35.41,24.63 34.48,25.55 33.79,25.55 33.02,26.32 33.02,27 32.01,28.01 29.32,28.01 29.1,28.23 23.83,28.23 23.58,28.48 23.58,30.16 U$1.19
  Bottom 0.508: 35.41,23.9 39.14,20.16 | U$5.P2 67.31,30.48 67.31,29.37 59.85,21.91 59.85,19.53 59.05,18.73 48.58,18.73 47.15,20.16
  Bottom 0.61: 39.14,20.16 47.15,20.16
FEEDBACK_B  (via drill 0.9 pad 1.35)
  Top 0.61: v23.02,21.84 23.02,31.73 v20.29,34.47
  Bottom 0.356: v23.02,21.84 23.58,21.27 U$1.26 | U$10.P2 62.13,39.21
  Bottom 0.61: v20.29,34.47 34.81,48.99 53.41,48.99 59.69,42.7 59.69,41.12 61.59,39.21 U$10.P2 | U$10.P2
FEEDBACK_C  (via drill 0.9 pad 1.35)
  Top 0.61: v37.42,17.29 36.93,17.77 33.66,17.77 32.87,18.57 32.87,30.03 32.37,30.52 28.6,30.52 v26.1,33.03
  Bottom 0.356: v26.1,33.03 25.64,33.03 25.31,32.7 U$1.17
  Bottom 0.508: v37.42,17.29 38.59,18.47 46.3,18.47 47.48,17.28 59.85,17.28 60.98,18.41 U$11.P2
GND  (via drill 0.9 pad 1.35)
  Top 0.356: JP1.6 12.7,30.63 10.97,30.63 4.45,24.11 X3.1 4.45,21.61 6.6,19.45 6.6,16.11 4.45,13.95 X4.1 | 77.61,43.47 77.32,43.18 | 39.68,36.19 | 39.68,36.19 R41.2
  Top 0.61: 41.91,3.45 U$6.2 41.91,9.53 41.28,10.16 C15.1 | 42.23,3.49 41.91,3.81 41.91,3.45 | SV8.1 39.73,3.45 41.91,3.45 | 77.32,43.18 SV2.2 | X1.2 81.92,12.68 79.54,15.06 79.54,38.82 82.44,41.72 82.44,42.99 81.96,43.47 77.61,43.47 | v36.91,35.35 36.91,35.63 37.47,36.19 C22.1 39.68,36.19 | D5.1 70.6,42.57 71.26,41.91 76.2,41.91 | 44.77,3.49 C14.2 | R41.2 41.59,36.2 41.75,36.04 41.75,33.5 41.27,33.02 40.96,33.02 R11.1 C21.1
  Top 1.016: SV2.2 76.2,41.91 SV2.4 SV2.6 SV2.8
  Top 1.93: R1.1 47.62,3.49 v45.4,3.49 44.77,3.49 42.23,3.49
  Bottom 0.356: 19.1,23.71 19.1,20.9 17.54,19.34 14.9,19.34 14.69,19.13 14.69,17.06 14.95,16.8 16.37,16.8 16.61,16.56 16.61,15.81 16.33,15.53 14.66,15.53 14.54,15.4 14.54,14.51 14.79,14.26 21.45,14.26 | 30.54,5.18 32.2,5.18 32.87,5.85 32.87,7.47 SV8.1 35.41,10.01 35.41,11.1 38.26,13.95 38.75,13.95 | 19.1,23.71 23.48,23.71 23.58,23.81 U$1.24 25.56,23.81 25.56,23.82 C17.1 | 19.1,23.71 16.52,23.71 16.42,23.81 U$1.9 15.13,23.81 14.69,23.81 14.44,24.07 14.44,24.13 C19.1 | 13.78,29.55 16.83,29.55 30.37,43.09 32.55,43.09 33.01,42.63 | SV2.2 75.56,43.82 C20.2 | C17.1 C18.2 | C17.1 C16.1
  Bottom 0.406: SV2.4 C12.1 | SV2.6 C11.1 | SV2.8 C10.1
  Bottom 0.508: 14.54,14.51 14.06,14.51 12.7,15.88 11.91,15.88 U$13.P2
  Bottom 0.61: 21.45,14.26 30.54,5.18 | 5.01,14.51 4.45,13.95 X4.1 | U7.4 38.75,13.95 38.73,13.97 38.73,16.51 39.37,17.14 R9.1 R8.1 C1.1 45.72,17.14 46.35,16.51 51.12,16.51 52.39,15.24 C7.1 R21.2 | 13.78,29.55 12.7,30.63 JP1.6 | 39.05,44.13 34.52,44.13 33.01,42.63 33.01,38.72 33.69,38.05 34.83,38.05 36.91,35.97 v36.91,35.35 36.91,33.47 38.73,31.65 | U8.4 38.73,29.21 38.73,31.65 | 39.05,44.13 38.73,44.45 38.73,46.99 39.37,47.62 R13.1 R12.1 C3.1 45.72,47.62 46.35,46.99 51.12,46.99 52.39,45.72 C9.1 R25.2 | 39.05,44.13 U9.4 | 38.73,31.65 38.73,31.75 39.37,32.38 R11.1 | R10.1 42.54,32.38 C2.1 45.72,32.38 46.35,31.75 51.12,31.75 52.39,30.48 C8.1 R23.2
  Bottom 0.813: R10.1 42.54,32.38 42.55,32.38 R10.1 | R11.1 R10.1
  Bottom 1.27: 75.57,3.33 75.57,9.37 76.36,10.16
  Bottom 1.422: v45.4,3.49 45.72,3.17 75.25,3.17 75.57,3.33
  Bottom 2.54: 76.36,10.16 81.92,10.16 X1.2
  pour Top (isolate 0.61): 2.54,50.8 2.54,2.54 83.82,2.54 83.82,50.8
  pour Bottom (isolate 0.61): 2.54,50.8 83.82,50.8 83.82,2.54 2.54,2.54
GND_ABOVE_SHUNT
  Top 0.61: R34.2 R33.1 R34.2 47.31,9.53
  Top 1.016: R1.2 47.36,9.52 46.67,9.52 47.31,9.53 47.25,11.37 47.62,11.37
  Top 2.184: 47.62,26.61 47.62,26.67 | 47.62,26.61 47.62,11.37 U2.2 | 47.62,41.85 47.62,42.23 | 47.62,26.67 47.62,41.85 | 47.62,41.85 U6.2 | 47.62,26.61 47.62,26.67 | 47.62,26.61 U4.2
  Top 2.54: 47.62,41.85 47.62,42.23
H_A
  Bottom 0.356: U$4.2 28.8,39.37 17.06,27.62 U$1.12
H_A_2
  Bottom 0.61: R44.1 36.36,39.05 36.04,39.37 U$4.1
H_A_D
  Bottom 0.356: R44.2 37.88,40.96
  Bottom 0.61: 37.88,40.96 38.2,41.28 U9.2 41.59,41.28 41.91,41.59 41.91,45.41 R12.2
H_B
  Bottom 0.356: U$3.2 33.17,25.25 33.17,23.63 33.94,22.86 34.67,22.86 35.46,22.07 35.46,16.03 34.52,15.09 33.79,15.09 33.02,14.32 33.02,13.64 32.23,12.85 31.15,12.85 27.84,16.17 26.96,16.17 26.32,15.53
  Bottom 0.406: U$1.2 16.67,14.92 16.83,14.92 22.54,14.92 23.18,15.56 26.29,15.56 26.32,15.53
H_B_2
  Bottom 0.61: R43.1 36.2,24.13 36.2,25.88 35.41,26.67 U$3.1
H_B_D
  Bottom 0.356: 38.2,26.04 U8.2 | R43.2 37.88,25.71
  Bottom 0.61: 37.88,25.71 38.2,26.04 | U8.2 41.59,26.04 41.91,26.35 41.91,30.16 R10.2
H_C
  Bottom 0.356: 30.63,3.81 U$2.2 | U$1.1 20.79,13.65
  Bottom 0.61: 20.79,13.65 30.63,3.81
H_C_2
  Bottom 0.508: U$2.1 34.29,4.29 37.46,7.46 R42.1 | R42.1
H_C_D
  Bottom 0.356: U7.2 38.2,10.79 37.88,10.47 R42.2
  Bottom 0.61: U7.2 41.59,10.79 41.91,11.11 41.91,14.92 R8.2
HALL_A
  Bottom 0.356: R27.1 73.02,35.72 73.18,35.56 SV2.7
HALL_A_FILT
  Bottom 0.356: U$5.P3 70.01,31.88 71.92,33.79 R27.2
  Bottom 0.61: C10.2 79.69,36.83 75.57,36.83 74.93,36.2 74.93,34.93 73.82,33.81 R27.2
  Bottom 1.016: C10.2 R30.1
HALL_B
  Bottom 0.406: R28.1 SV2.5
HALL_B_FILT
  Bottom 0.508: 70.17,39.37 65.86,39.37 63.48,41.75 U$10.P3
  Bottom 0.61: C11.2 79.69,39.37 70.17,39.37 R28.2
  Bottom 1.016: C11.2 R31.1
HALL_C
  Bottom 0.356: SV2.3 74.78,40.64 74.78,40.92 75.62,41.76 77,41.76 R29.1
HALL_C_FILT  (via drill 0.9 pad 1.35)
  Top 0.61: v81.24,42.26 78.65,39.67 78.65,13.28 75.61,10.4 | 65.72,15.24 65.64,15.32 63.82,17.14 63.82,19.37 U$11.P3
  Top 1.016: 75.61,10.4 75.61,3.53 75.25,3.17 66.2,3.17 65.56,3.81 65.56,15.24 65.64,15.32
  Bottom 0.356: 79.69,42.13 81.11,42.13 v81.24,42.26
  Bottom 0.61: R29.2 79.69,42.13 C12.2
  Bottom 1.016: C12.2 R32.1
L_A
  Bottom 0.356: U$4.4 30.26,41.91 17.25,28.89 16.42,28.89 U$1.13
L_A_2
  Bottom 0.61: U$4.3 35.41,41.91 36.04,42.55 U9.3 40.64,42.55 40.96,42.86 40.96,44.45 40.32,45.09 R13.2
L_B  (via drill 0.9 pad 1.35)
  Top 0.61: U$3.4 31.75,28.09 31.47,28.09 27.4,24.02 v27.4,14.97
  Bottom 0.356: U$1.31 25.31,14.92 25.36,14.97 v27.4,14.97
L_B_2
  Bottom 0.61: U$3.3 35.41,29.21 37.31,27.3 U8.3 40.64,27.3 40.96,27.62 40.96,29.21 40.95,29.21 40.32,29.84 R11.2
L_C
  Bottom 0.61: U$1.32 U$2.4
L_C_2
  Bottom 0.356: U$2.3 34.29,7.47 34.52,7.47 36.07,9.02 36.07,10.99 37.14,12.06 U7.3
  Bottom 0.61: U7.3 40.64,12.06 40.96,12.38 40.96,13.97 40.32,14.61 R9.2
MISO_A  (via drill 0.9 pad 1.35)
  Top 0.61: JP1.1 10.16,35.71 10.44,35.71 11.28,34.87 11.28,34.09 11.28,33.81 12.07,33.02 13.34,33.02 14.13,32.23 14.13,26.1 13.82,25.79 13.14,25.11 13.14,20.05 14.89,18.3 v18.05,18.3 26.23,10.12 29.41,10.12 30.63,8.89 SV8.2
  Bottom 0.356: U$1.5 17.62,18.73 v18.05,18.3
MOSI_A  (via drill 0.9 pad 1.35)
  Top 0.356: v14.18,20.51 14.36,20.69
  Top 0.61: JP1.4 13.34,34.29 15.08,32.54 15.08,21.41 v14.18,20.51
  Bottom 0.356: U$1.6 14.69,20 v14.18,20.51
N$4  (via drill 0.9)
  other vias: 63.34,10.79
N$5
  Top 0.356: R39.2 40.81,30 40.96,29.85
  Top 0.61: 40.96,29.85 R38.1
N$6  (via drill 0.9 pad 1.35)
  other vias: 68.42,10.79
N$9
  Bottom 0.61: R25.1 R24.2
N$10
  Top 0.356: 71.32,49.69 71.33,49.68
  Top 0.61: U$12.P1 71.33,49.53 71.33,49.68 | R26.1 71.32,49.69
N$12
  Bottom 0.61: R16.1 R19.2
N$13
  Bottom 0.61: R23.1 R22.2
N$15
  Bottom 0.61: R15.1 R18.2
N$16
  Bottom 0.61: R21.1 R20.2
N$19
  Bottom 0.61: R14.1 R17.2
NRES
  Bottom 0.508: U$1.3 14.29,16.19 13.81,16.67
  Bottom 0.61: 8.48,31.19 9.04,31.75 JP1.5 | 8.48,31.19 7.41,30.12 7.41,21.16 8.1,20.48 12.22,20.48 13.81,18.89 13.81,16.67 | 8.48,31.19 7.34,32.34 R37.2
PHASE_A  (via drill 0.6 pad 1.01, 1.1 pad 1.65)
  Top 0.61: v50.48,35.24 50.45,35.21 50.45,34.57
  Top 1.778: U6.3 57.15,44.13 53.02,40.01 53.02,35.56 52.07,34.61 50.48,34.61 50.45,34.57 U5.2
  Top 1.93: 68.58,38.42 70.64,36.35 70.64,33.5 73.03,31.11
  Top 2.184: 73.03,31.11 v73.82,31.11 | U6.3 63.98,44.13 64.61,43.5 64.61,38.58 64.77,38.42 68.58,38.42
  Bottom 0.61: 52.07,38.74 53.34,40.01 R16.2 | 52.07,38.74 49.53,41.28 47.94,41.28 46.67,42.55 U9.6 44.45,42.55 44.13,42.23 44.13,38.42 C4.2 | 52.07,38.74 52.07,36.83 v50.48,35.24
  Bottom 2.184: v73.82,31.11 81.28,31.11 X2.1
PHASE_B  (via drill 0.6 pad 1.01, 1.1 pad 1.65)
  Top 0.61: U3.2 50.48,19.03 50.48,19.05 v50.48,20
  Top 1.778: U4.3 57.15,28.89 53.02,24.77 53.02,20 52.39,19.05 50.48,19.05 50.45,19.01 U3.2
  Top 2.184: U4.3 58.9,28.89 61.91,25.88 v71.76,25.88
  Bottom 0.61: 52.07,23.5 53.34,24.77 R15.2 | 52.07,23.5 49.53,26.04 47.94,26.04 46.67,27.3 U8.6 44.45,27.3 44.13,26.99 44.13,23.81 44.45,23.49 C5.2 | 52.07,23.5 52.07,21.59 v50.48,20
  Bottom 2.184: v71.76,25.88 71.76,27.94 72.23,28.42 81.6,28.42 81.92,28.1 X2.2
PHASE_C  (via drill 0.6 pad 1.01, 0.9 pad 1.35)
  Top 0.61: v50.48,5.08 50.48,3.79 U1.2
  Top 1.016: v50.48,5.08 51.12,4.45
  Top 1.778: 53.02,9.53 57.15,13.65 U2.3
  Top 1.93: 51.12,4.45 51.44,4.13 52.7,4.13 53.02,4.45 53.02,9.53
  Top 2.184: U2.3 57.9,13.49 v62.23,13.49
  Bottom 0.61: 51.91,8.73 52.07,8.57 52.07,5.08 v50.48,5.08 | 51.91,8.73 52.7,9.53 R14.2 | 51.91,8.73 49.85,10.79 47.94,10.79 46.67,12.06 U7.6 44.45,12.06 44.13,11.75 44.13,7.94 C6.1
  Bottom 2.184: v62.23,13.49 70.48,13.49 74.61,17.62 74.61,17.78 78.11,17.78 X2.3
PSCIN0
  Bottom 0.356: SV8.6 30.95,13.97 28.07,16.85 19.18,16.85 18.89,17.14 17.3,17.14 16.99,17.46 U$1.4
PSCIN0_2
  Top 0.61: SV8.5 34.29,12.85 34.84,12.85 35.71,11.98 35.71,9.22 38.29,6.63 40.96,6.63 U$6.1
PSCIN1  (via drill 0.9 pad 1.35)
  Top 0.61: v18.06,21.33 27.96,11.43 SV8.4
  Bottom 0.356: U$1.7 18,21.27 v18.06,21.33
PSCOUT22  (via drill 0.9 pad 1.35)
  Top 0.61: v29.61,29.17 24.29,23.85 24.29,21.27 23.49,20.48 22.7,20.48 18.61,24.57 v18.61,24.82
  Bottom 0.356: U$1.10 16.42,25.08 16.68,24.82 v18.61,24.82
  Bottom 0.61: v29.61,29.17 29.61,29.29 30.8,30.48 32.38,30.48 33.02,31.11 33.02,35.56 U$9.P1
PSCOUT23
  Bottom 0.356: U$9.P2 30.69,36.83 27.22,36.83 16.74,26.35 U$1.11
SCK_A
  Bottom 0.61: JP1.3 10.8,34.29 12.07,33.02 14.45,33.02 15.24,33.02 U$1.16
V_SHUNT_M
  Top 0.61: SV7.5 35.41,21.59 41.75,15.24 C13.1
V_SHUNT_P
  Top 0.61: SV7.7 34.29,23.01 35.72,23.01 43.65,15.08 C13.2 R33.2
VB_A
  Bottom 0.61: D3.1 45.97,36.45 46.35,36.83 C4.1 46.35,39.69 46.04,40.01 U9.8
VB_B
  Bottom 0.61: U8.8 46.04,24.77 46.35,24.45 C5.1 46.35,21.59 45.97,21.21 D2.1
VB_C
  Bottom 0.61: D1.1 45.97,5.97 46.35,6.35 C6.2 46.35,9.21 46.04,9.53 U7.8
VCC
  Bottom 0.356: 12.12,22.11 12.23,22.23 | U$1.8 14.69,22.54 14.44,22.29 14.44,22.23
  Bottom 0.61: R36.2 12.12,21.91 12.12,22.11 | 12.23,22.23 C19.2 14.44,22.23
VCC_5V  (via drill 0.9 pad 1.35)
  Top 0.61: v36.5,14.75 37.95,13.29 37.95,8.26 C15.2 40.93,8.26 U$6.5 | SV8.3 33.02,12.7 27.94,12.7 26.04,14.61 26.04,15.4 17.4,24.03 17.4,32.13 JP1.2 | SV8.3
  Bottom 0.356: R37.1 6.23,35.24 6.23,30.85 6.59,30.5 | 63.48,40.48 61.52,40.48 | 9.21,22.07 R36.1 | SV2.1 73.66,44.3 C20.1
  Bottom 0.508: 61.52,40.48 60.81,41.2 60.81,42.25 63.96,45.4 72.66,45.4 C20.1 | 63.48,40.48 65.5,38.46 67.58,38.46 69.98,36.06 69.98,33.32 68.75,32.08 68.75,29.38 68.59,29.38 68.1,28.89 60.64,21.43 60.64,19.21 59.47,18.04 47.91,18.04 46.78,19.16 37.76,19.16 37.7,19.21 36.67,19.21 36.2,18.73 36.2,16.51 36.5,16.21 v36.5,14.75 36.51,14.73 36.51,13.65 SV8.3 | SV8.3
  Bottom 0.61: X4.2 4.45,19.03 6.59,21.18 6.59,30.5 | 9.21,22.07 9.21,23.01 8.57,23.65 8.57,27.79 R35.1 8.57,29.69 9.21,30.32 10.64,30.32 11.43,31.11 11.43,32.38 10.8,33.02 9.53,33.02 8.73,33.81 8.73,34.96 | R37.1 8.45,35.24 8.73,34.96 | JP1.2 11.43,35.56 9.21,35.56 8.73,35.08 8.73,34.96 | R30.2 83.18,34.45 82.87,34.13 75.57,34.13 74.3,32.86 73.18,32.86 71.6,31.27 71.6,30.16 70.48,29.05 69.08,29.05 68.75,29.38
  Bottom 1.016: R30.2 R31.2 R32.2
VCC_DRV  (via drill 1.1 pad 1.65)  (1 unrouted)
  Top 0.508: 7.62,40.64 11.43,40.64 11.43,44.45
  Top 0.61: 33.02,49.85 33.02,31.08 33.62,30.48 35.62,30.48 37.59,28.52 43.44,28.52 v45.4,30.48
  Top 1.016: v45.4,15.24 v45.4,30.48 v45.4,45.72 | 33.02,49.85 26.51,49.85 26.19,49.53
  Top 1.93: D5.2 68.13,46.97 66.83,48.26 66.83,49.37 66.68,49.53
  Top 2.54: X3.2 4.45,40.64 7.62,40.64 | 11.43,44.45 11.43,49.53 26.19,49.53 66.68,49.53
  Bottom 0.61: D1.3 40.6,9.49 40.64,9.53 | 40.64,40.01 40.6,39.97 D3.3 | C3.2 44.13,45.09 42.86,43.82 42.86,40.32 42.55,40.01 40.64,40.01 | 40.64,40.01 U9.1 | 40.64,9.53 42.55,9.53 42.86,9.84 42.86,13.33 44.13,14.61 C1.2 | 40.64,9.53 U7.1 | 40.64,24.77 40.6,24.73 D2.3 40.6,23.22 40.64,23.18 | 40.64,24.77 42.55,24.77 42.86,25.08 42.86,28.57 44.13,29.84 C2.2 | 40.64,24.77 U8.1
  Bottom 1.016: v45.4,30.48 C2.2 | C1.2 v45.4,15.24 | v45.4,45.72 C3.2
VCC_POWER_RAW  (via drill 0.6 pad 1.01, 0.9 pad 1.35)  (1 unrouted)
  Top 1.422: v73.5,10.79 X5.1 | U1.3 57.78,6.07 57.78,7.62 X5.3
  Top 2.184: 76.68,27.4 | 76.68,27.4 | 76.68,27.4 76.43,28.03 76.5,28.42 63.02,28.42 62.39,29.05 | 62.39,29.05 | 62.39,29.05 62.39,33.97 62.07,34.29 59.69,34.29 58.58,35.4 58.58,36.51 | 76.68,27.4 D4.1 | 76.68,27.4 76.68,14.76 v76.68,14.29 73.5,11.11 v73.5,10.79 X5.1 | 76.68,27.4 76.68,28.42 | 58.58,36.51 59.05,36.51 | 58.58,36.51 U5.3 | U3.3 58.42,21.27 60.48,23.34 68.1,23.34 70.8,20.64 70.8,13.81 68.42,11.43 X5.2 | X5.3 63.34,10.64
  Bottom 2.184: v73.5,10.79 72.39,10.79 72.07,10.48
  Bottom 2.54: 73.03,11.27 76.04,14.29 v76.68,14.29 81.92,14.29 X1.1 | 63.34,10.48 72.07,10.48 72.07,7.62 X5.2 X5.3 63.34,10.48
VCC_POWER_RECT
  Top 0.356: 76.21,31.41 D4.2
  Top 0.61: R38.2 43.66,33.34 43.66,46.36 44.74,47.44 45.35,47.44 63.38,47.44 65.9,44.93 66.68,44.93 | 66.68,44.93 70.33,44.93 U$12.P2 | 76.21,31.41 73.64,33.97 73.03,33.97 72.23,34.77 72.23,37.31 68.9,40.64 66.83,40.64 66.68,40.8 66.68,44.93
VMOT
  Top 0.356: 38.42,31.11 R39.1 | 38.42,31.11 | C21.2 38.42,31.11 | R40.1 37.41,31.91
  Top 0.61: 37.41,31.91 C21.2 | R40.1 35.57,31.91 35.41,31.75 U$8.1
VMOT_HALF
  Top 0.356: 39.22,34.29 C22.2 38.42,34.29 37.94,33.81
  Top 0.61: U$8.3 35.41,34.29 35.41,34.13 35.72,33.81 R40.2 37.94,33.81 | 39.22,34.29 R41.1
(copper drawn outside any net)
  shapes: Bottom area x4, Top area x4

### Text on the board
Measures: 49.53 | 39 | 33.4 | 25.4 | 48.26 | 16 | 17.4 | 4.8 | 1.27 | 0 | 16.89 | 40.64 | 64.39 | 81.28 | 47.5
Document: D4 should be connected directly to VCC_POWER_RAW | FEEDBACK_C inside jumpers too close to jumpers
tDocu: ERRORS | X1.2,X3,X4 cannot be soldered from top | MCU is too narrow